# EAGLE design simple-slave (EAGLE 9.6.2)
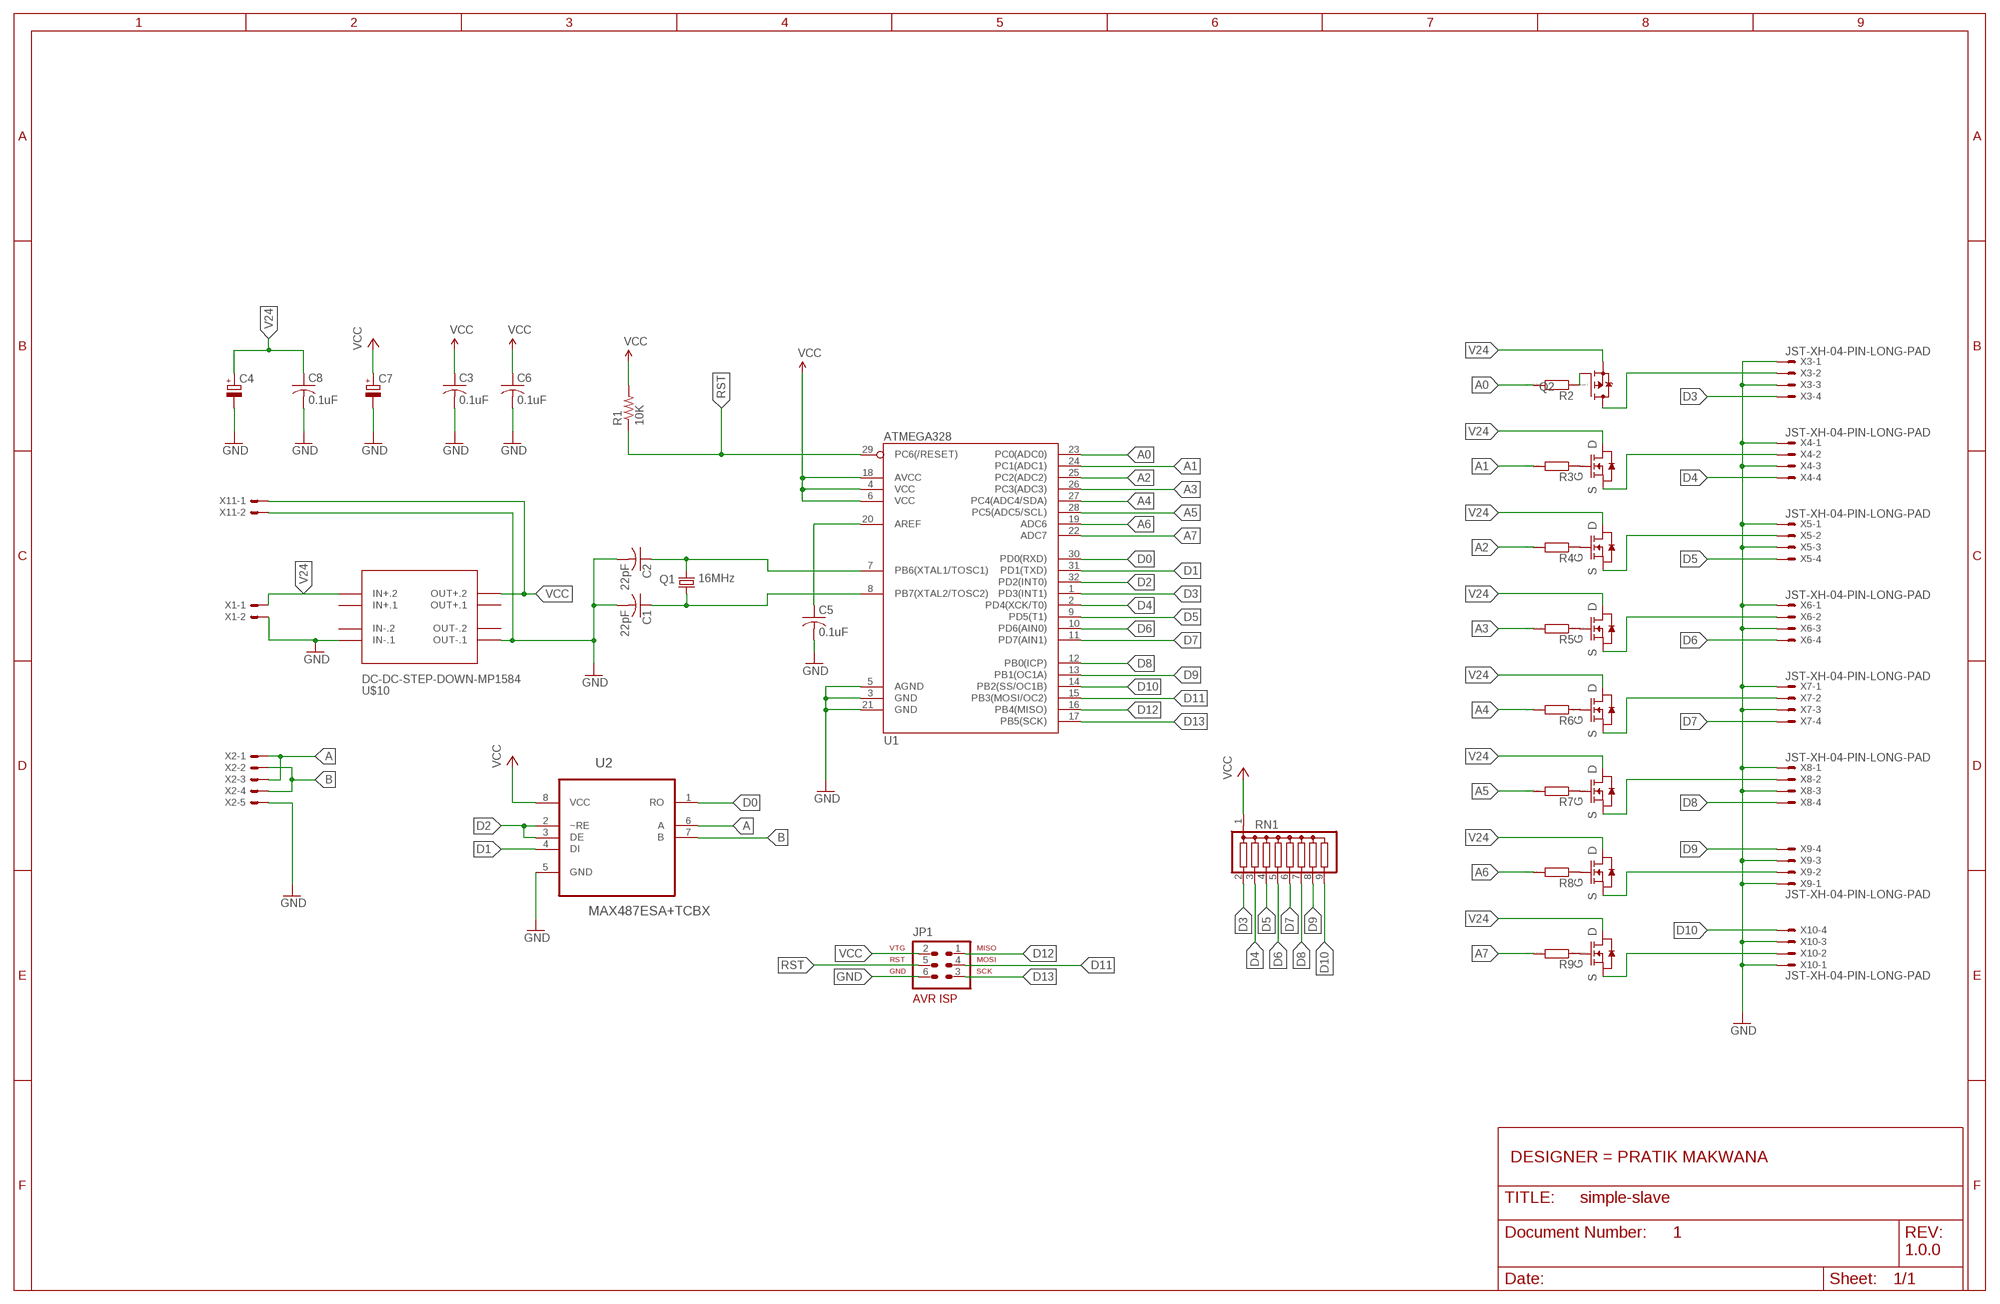
[diagram p0: schematic, sheet 1]
FRAME1 (FRAME_B_L): DESIGNER: PRATIK MAKWANA; DOC: 1; REV: 1.0.0

## Parts
C1  22pF  C-USC1206  [C1206]
C2  22pF  C-USC1206  [C1206]
C3  0.1uF  C-USC0805  [C0805]
C4  CPOL-EUSANYO_SMD_C6  [SANYO-OSCON_SMD_C6]
C5  0.1uF  C-USC0805  [C0805]
C6  0.1uF  C-USC0805  [C0805]
C7  CPOL-EUSANYO_SMD_C6  [SANYO-OSCON_SMD_C6]
C8  0.1uF  C-USC0805  [C0805]
JP1  AVR-ISP-6  [AVR-ISP-6]
Q1  16MHz  CRYTALHC49S  [HC49/S]
Q2  SPD30P06PTO252  [TO252]
R1  10K  R-US_R1206  [R1206]
R2  RR1206  [R1206]
R3  RR1206  [R1206]
R4  RR1206  [R1206]
R5  RR1206  [R1206]
R6  RR1206  [R1206]
R7  RR1206  [R1206]
R8  RR1206  [R1206]
R9  RR1206  [R1206]
RN1  G08R  [SIL9]
U1  ATMEGA328  [TQFP32-08]
U2  MAX487ESA+TCBX  [SOIC127P600X175-8N]
U$2  MOSFET-NTO252  [TO252]
U$3  MOSFET-NTO252  [TO252]
U$4  MOSFET-NTO252  [TO252]
U$5  MOSFET-NTO252  [TO252]
U$6  MOSFET-NTO252  [TO252]
U$7  MOSFET-NTO252  [TO252]
U$8  MOSFET-NTO252  [TO252]
U$10  DC-DC-STEP-DOWN-MP1584  [DC-DC-STEP-DOWN-MP1584]
X1  JST-XH-02-PIN-LONG-PAD  [JST-XH-02-PACKAGE-LONG-PAD]
X2  JST-XH-05-PIN-LONG-PAD  [JST-XH-05-PACKAGE-LONG-PAD]
X3  JST-XH-04-PIN-LONG-PAD  [JST-XH-04-PACKAGE-LONG-PAD]
X4  JST-XH-04-PIN-LONG-PAD  [JST-XH-04-PACKAGE-LONG-PAD]
X5  JST-XH-04-PIN-LONG-PAD  [JST-XH-04-PACKAGE-LONG-PAD]
X6  JST-XH-04-PIN-LONG-PAD  [JST-XH-04-PACKAGE-LONG-PAD]
X7  JST-XH-04-PIN-LONG-PAD  [JST-XH-04-PACKAGE-LONG-PAD]
X8  JST-XH-04-PIN-LONG-PAD  [JST-XH-04-PACKAGE-LONG-PAD]
X9  JST-XH-04-PIN-LONG-PAD  [JST-XH-04-PACKAGE-LONG-PAD]
X10  JST-XH-04-PIN-LONG-PAD  [JST-XH-04-PACKAGE-LONG-PAD]
X11  JST-XH-02-PIN-LONG-PAD  [JST-XH-02-PACKAGE-LONG-PAD]

## Nets
A: U2.6(A) X2.1 X2.3
A0: R2.2 U1.23(PC0(ADC0))
A1: R3.2 U1.24(PC1(ADC1))
A2: R4.2 U1.25(PC2(ADC2))
A3: R5.2 U1.26(PC3(ADC3))
A4: R6.2 U1.27(PC4(ADC4/SDA))
A5: R7.2 U1.28(PC5(ADC5/SCL))
A6: R8.2 U1.19(ADC6)
A7: R9.2 U1.22(ADC7)
AREF: C5.1 U1.20(AREF)
B: U2.7(B) X2.2 X2.4
D0: U1.30(PD0(RXD)) U2.1(RO)
D1: U1.31(PD1(TXD)) U2.4(DI)
D2: U1.32(PD2(INT0)) U2.2(~RE) U2.3(DE)
D3: RN1.2 U1.1(PD3(INT1)) X3.4
D4: RN1.3 U1.2(PD4(XCK/T0)) X4.4
D5: RN1.4 U1.9(PD5(T1)) X5.4
D6: RN1.5 U1.10(PD6(AIN0)) X6.4
D7: RN1.6 U1.11(PD7(AIN1)) X7.4
D8: RN1.7 U1.12(PB0(ICP)) X8.4
D9: RN1.8 U1.13(PB1(OC1A)) X9.4
D10: RN1.9 U1.14(PB2(SS/OC1B)) X10.4
D11: JP1.4 U1.15(PB3(MOSI/OC2))
D12: JP1.1 U1.16(PB4(MISO))
D13: JP1.3 U1.17(PB5(SCK))
GND: C1.2 C2.2 C3.2 C4.- C5.2 C6.2 C7.- C8.2 JP1.6 U1.3(GND) U1.5(AGND) U1.21(GND) U2.5(GND) U$10.IN-.1 U$10.OUT-.1 X1.2 X2.5 X3.1 X3.3 X4.1 X4.3 X5.1 X5.3 X6.1 X6.3 X7.1 X7.3 X8.1 X8.3 X9.1 X9.3 X10.1 X10.3 X11.2
N$1: Q2.1(G) R2.1
N$2: R3.1 U$2.P1(G)
N$4: R4.1 U$3.P1(G)
N$5: R5.1 U$4.P1(G)
N$6: R6.1 U$5.P1(G)
N$7: R7.1 U$6.P1(G)
N$8: R8.1 U$7.P1(G)
N$9: R9.1 U$8.P1(G)
N$11: Q2.3(D) X3.2
N$12: U$2.P3(S) X4.2
N$13: U$3.P3(S) X5.2
N$14: U$4.P3(S) X6.2
N$15: U$5.P3(S) X7.2
N$16: U$6.P3(S) X8.2
N$18: U$7.P3(S) X9.2
N$19: U$8.P3(S) X10.2
N$43: C2.1 Q1.2 U1.7(PB6(XTAL1/TOSC1))
N$44: C1.1 Q1.1 U1.8(PB7(XTAL2/TOSC2))
RST: JP1.5 R1.1 U1.29(PC6(/RESET))
V24: C4.+ C8.1 Q2.2(S) U$2.P2(D) U$3.P2(D) U$4.P2(D) U$5.P2(D) U$6.P2(D) U$7.P2(D) U$8.P2(D) U$10.IN+.2 X1.1
VCC: C3.1 C6.1 C7.+ JP1.2 R1.2 RN1.1 U1.4(VCC) U1.6(VCC) U1.18(AVCC) U2.8(VCC) U$10.OUT+.2 X11.1
Unconnected: U$10.IN+.1 U$10.IN-.2 U$10.OUT+.1 U$10.OUT-.2

## Library data of the parts
C1-C3 C5 C6 C8 = adafruit:C-US: CAPACITOR, American symbol
C4 C7 = rcl:CPOL-EU: POLARIZED CAPACITOR, European symbol; SPICEPREFIX: C
JP1 = atmel-1:AVR-ISP-6: AVR ISP-6 Serial Programming Header
Q1 = crystal:CRYTAL: CRYSTAL
Q2 = transistor-fet:SPD30P06P: SIPMOS(R) Power-Transistor P-Channel, Enhancement mode Source: http://www.infineon.com/upload/Document/cmc_upload/documents/012/3615/SPD_U30P06P.pdf
R1 = adafruit:R-US_: RESISTOR, American symbol
R2-R9 = eagle-ltspice:R: RESISTOR, European symbol; SPICEMODEL: NONE; SPICEPREFIX: R
RN1 = resistor-sil:G08R: SIL RESISTOR; OC_FARNELL: unknown; OC_NEWARK: unknown
U1 = thecustomgeek:ATMEGA328: ATmega328P-AU TQFP 32 pin
U2 = MAX487ESA_TCBX:MAX487ESA+TCBX: Low-Power, Slew-Rate-Limited RS-485/RS-422 Transceivers Check prices <https://pricing.snapeda.com/parts/MAX487ESA%2BTCBX/Maxim%20Integrated/view-part?ref=eda>; AVAILABILITY: Warning; DESCRIPTION: 1/1 Transceiver Half RS422, RS485 8-SOIC; MF: Maxim Integrated; MP: MAX487ESA+TCBX; PACKAGE: SOIC-8 Maxim Integrated; PRICE: None; PURCHASE-URL: https://pricing.snapeda.com/search/part/MAX487ESA+TCBX/?ref=eda
U$2-U$8 = dawidkulpa_dev:MOSFET-N
U$10 = diy-modules:DC-DC-STEP-DOWN-MP1584: DC/DC Step-Down Regulator based on MP1584 chip MP1584 datasheet available here: http://www.haoyuelectronics.com/Attachment/MP1584/MP1584.pdf Click here to find device on ebay.com <http://www.ebay.com/sch/mp1584+module>
X1 X11 = Rembrandt Electronics - JST XH Connectors v1-0:JST-XH-02-PIN: JST XH Connector 2 Pin Wire to board connector. Pitch: 2,54 mm, (0.100") Number of pins: 2 Created by Rembrandt Electronics www.rembrandtelectronics.com
X2 = Rembrandt Electronics - JST XH Connectors v1-0:JST-XH-05-PIN: JST XH Connector 2 Pin Wire to board connector. Pitch: 2,54 mm, (0.100") Number of pins: 5 Created by Rembrandt Electronics www.rembrandtelectronics.com
X3-X10 = Rembrandt Electronics - JST XH Connectors v1-0:JST-XH-04-PIN: JST XH Connector 2 Pin Wire to board connector. Pitch: 2,54 mm, (0.100") Number of pins: 4 Created by Rembrandt Electronics www.rembrandtelectronics.com

## Board
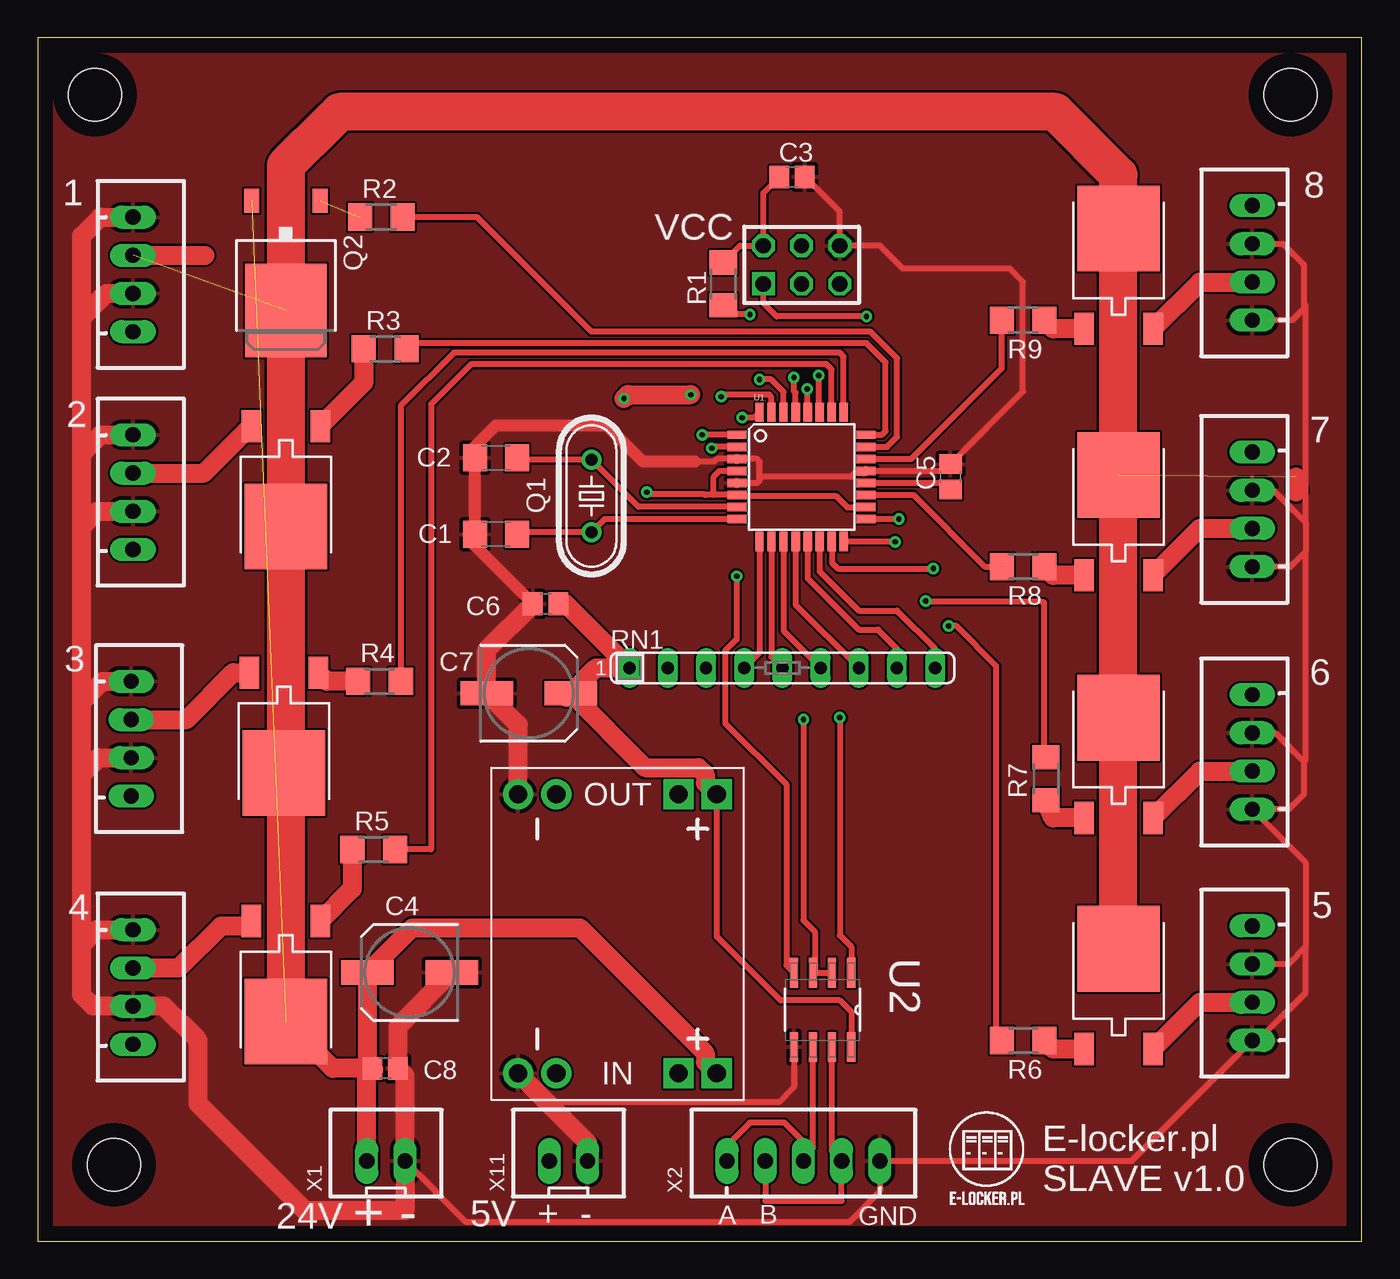
[diagram p1: board, top side]
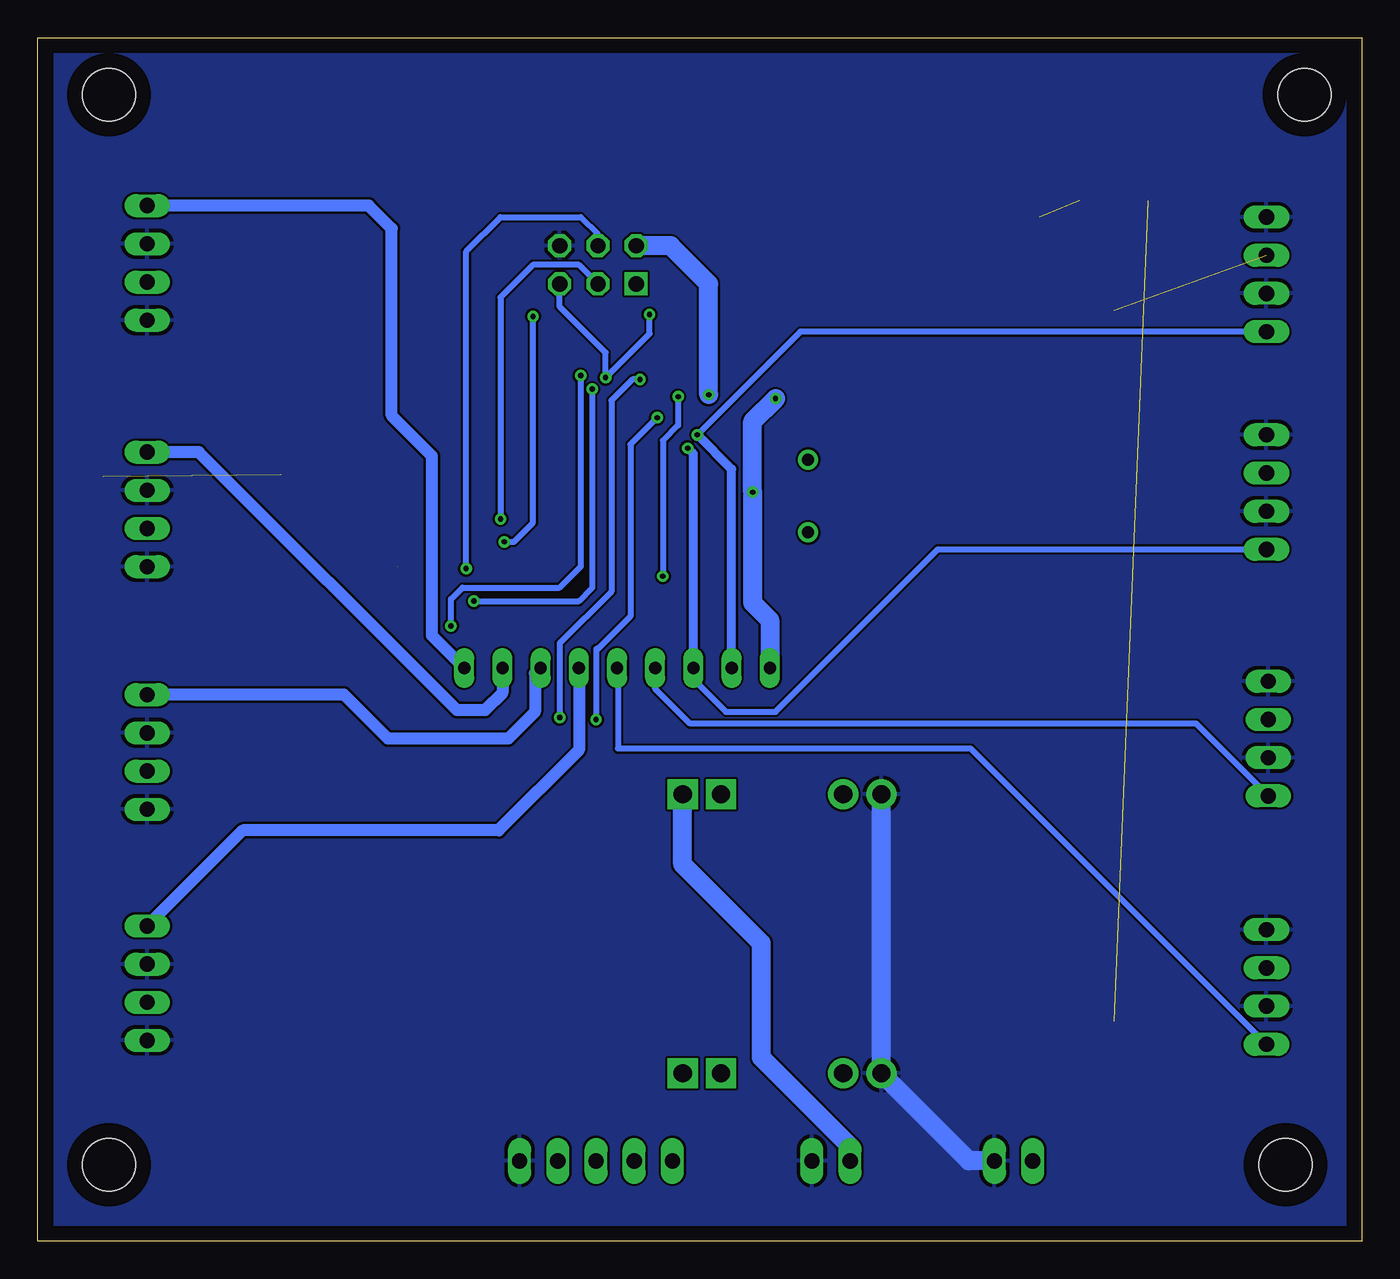
[diagram p2: board, bottom side, seen from below]

Size 88.06 x 80 mm. Coordinates in mm from the lower left corner, seen from the top.
Outline: 0,0 88.06,0 88.06,80 0,80 0,0
Copper layers (1*16): Top 0.035mm / dielectric 1.5mm / Bottom 0.035mm
Design rules "default": minimum track width 6mil, minimum drill 0.35mm, track to track 6mil, track to pad 6mil, pad to pad 6mil, via to via 6mil, smd to smd 6mil, copper to edge 40mil, drill to drill 6mil, minimum pad ring 10mil, minimum via ring 8mil, stop-mask expansion 4mil, vias tented up to drill 0mil, thermal gap 10mil
Holes 3.5 mm at 5.08,5.08 83.31,5.08 83.31,76.2 3.81,76.2

### Footprints (pad centres in the part's own frame; a part is rotated, then mirrored left to right if it is on the bottom)
C1206 = smd 1.6 x 1.8: 1 -1.4,0; 2 1.4,0
C0805 = smd 1.3 x 1.5: 1 -0.85,0; 2 0.85,0
SANYO-OSCON_SMD_C6 = smd 3.5 x 1.6: + 2.8,0; - -2.8,0
AVR-ISP-6 = drill 1.016 square: 1 -2.54,-1.27 | drill 1.016 octagon: 2 -2.54,1.27; 3 0,-1.27; 4 0,1.27; 5 2.54,-1.27; 6 2.54,1.27
HC49/S = drill 0.813: 1 -2.413,0; 2 2.413,0
TO252 = smd 1 x 1.6: 1 -2.28,-4.8; 2 2.28,-4.8 | smd 5.4 x 6.2: 3 0,2.5
R1206 = smd 1.6 x 1.803: 1 -1.422,0; 2 1.422,0
SIL9 = drill 0.813 long: 1 -10.16,0; 2 -7.62,0; 3 -5.08,0; 4 -2.54,0; 5 0,0; 6 2.54,0; 7 5.08,0; 8 7.62,0; 9 10.16,0
TQFP32-08 = smd 1.27 x 0.559: 1 -4.293,2.8; 2 -4.293,2; 3 -4.293,1.2; 4 -4.293,0.4; 5 -4.293,-0.4; 6 -4.293,-1.2; 7 -4.293,-2; 8 -4.293,-2.8; 17 4.293,-2.8; 18 4.293,-2; 19 4.293,-1.2; 20 4.293,-0.4; 21 4.293,0.4; 22 4.293,1.2; 23 4.293,2; 24 4.293,2.8 | smd 0.559 x 1.27: 9 -2.8,-4.293; 10 -2,-4.293; 11 -1.2,-4.293; 12 -0.4,-4.293; 13 0.4,-4.293; 14 1.2,-4.293; 15 2,-4.293; 16 2.8,-4.293; 25 2.8,4.293; 26 2,4.293; 27 1.2,4.293; 28 0.4,4.293; 29 -0.4,4.293; 30 -1.2,4.293; 31 -2,4.293; 32 -2.8,4.293
SOIC127P600X175-8N = smd 1.981 x 0.533: 1 -2.464,1.905; 2 -2.464,0.635; 3 -2.464,-0.635; 4 -2.464,-1.905; 5 2.464,-1.905; 6 2.464,-0.635; 7 2.464,0.635; 8 2.464,1.905
TO252' = smd 1.3 x 2.15: P1 -2.285,-4.38; P3 2.285,-4.38 | smd 5.5 x 5.7: P2 0,2.285
DC-DC-STEP-DOWN-MP1584 = drill 1.2 pad 2 square: IN+.1 -9.271,-4.064; IN+.2 -9.271,-6.604; OUT+.1 9.271,-4.064; OUT+.2 9.271,-6.604 | drill 1.2 pad 2: IN-.1 -9.271,6.604; IN-.2 -9.271,4.064; OUT-.1 9.271,6.604; OUT-.2 9.271,4.064
JST-XH-02-PACKAGE-LONG-PAD = drill 1.016 long: 1 -1.27,0; 2 1.27,0
JST-XH-05-PACKAGE-LONG-PAD = drill 1.016 long: 1 -5.08,0; 2 -2.54,0; 3 0,0; 4 2.54,0; 5 5.08,0
JST-XH-04-PACKAGE-LONG-PAD = drill 1.016 long: 1 -3.81,0; 2 -1.27,0; 3 1.27,0; 4 3.81,0

### Placement (x,y rotation side)
C1  30.48,46.99 180 top
C2  30.48,52.07 180 top
C3  50.16,70.74 0 top
C4  24.74,17.86 180 top
C5  60.71,50.8 90 top
C6  33.78,42.37 180 top
C7  32.66,36.42 0 top
C8  23.11,11.48 0 top
JP1  50.8,64.9 0 top
Q1  36.83,49.53 90 top
Q2  16.51,64.36 180 top
R1  45.59,63.63 90 top
R2  22.86,68.07 0 top
R3  23.11,59.31 0 top
R4  22.73,37.21 0 top
R5  22.35,26.04 0 top
R6  65.53,13.34 180 top
R7  67.06,30.73 90 top
R8  65.53,44.83 180 top
R9  65.53,61.21 180 top
RN1  49.53,38.1 0 top
U1  50.8,50.8 0 top
U2  52.2,15.37 270 top
U$2  [TO252']  16.51,49.78 180 top
U$3  [TO252']  16.38,33.4 180 top
U$4  [TO252']  16.51,16.89 180 top
U$5  [TO252']  71.88,17.14 0 top
U$6  [TO252']  71.88,32.51 0 top
U$7  [TO252']  71.88,48.64 0 top
U$8  [TO252']  71.88,65.02 0 top
U$9  [ELOCKER]  60.6,2.18 0 top
U$10  38.56,20.42 90 top
X1  23.16,5.33 0 top
X2  50.93,5.33 0 top
X3  6.35,64.26 270 top
X4  6.35,49.78 270 top
X5  6.22,33.4 270 top
X6  6.35,16.89 270 top
X7  80.77,17.14 90 top
X8  80.77,32.51 90 top
X9  80.77,48.64 90 top
X10  80.77,65.02 90 top
X11  35.31,5.33 0 top

### Tracks (layer width: path | path; a pad name or v marks a point on that pad's centre or on a via)
A
  Top 0.406: U2.6 51.56,6.22 51.44,6.1 | X2.3 50.93,5.59 51.44,6.1 | 51.44,6.1 49.66,7.87 47.37,7.87 45.85,6.35 X2.1
A0
  Top 0.406: U1.23 56.48,52.8 57.15,53.47 57.15,58.67 55.37,60.45 36.83,60.45 29.21,68.07 R2.2
A1
  Top 0.406: U1.24 56.14,53.6 56.39,53.85 56.39,58.42 55.12,59.69 24.92,59.69 R3.2
A2
  Top 0.406: U1.25 53.6,58.8 53.34,59.05 27.69,59.05 24.16,55.52 R4.2
A3
  Top 0.406: U1.26 52.8,57.94 52.45,58.29 28.83,58.29 26.16,55.63 26.16,26.04 R5.2
A4  (via drill 0.35)
  Top 0.406: U1.27 51.94,55.15 v51.94,57.53 | R6.2 63.75,13.69 63.75,38.23 61.09,40.89 v60.58,40.89
  Bottom 0.406: v60.58,40.89 60.58,42.67 59.82,43.43 53.34,43.43 51.94,44.83 v51.94,57.53
A5  (via drill 0.35)
  Top 0.406: U1.28 51.18,55.11 v51.18,56.64 | R7.2 66.93,32.28 66.93,42.46 66.53,42.55 v59.05,42.55
  Bottom 0.406: v51.18,56.64 51.18,43.43 52.07,42.55 v59.05,42.55
A6  (1 unrouted)
  Top 0.406: U1.19 58.22,49.6 62.99,44.83 R8.2
A7
  Top 0.406: U1.22 58.1,52 64.11,58.01 R9.2
AREF
  Top 0.406: U1.20 60.26,50.4 C5.1
B
  Top 0.406: U2.7 52.83,5.97 X2.4 53.47,2.67 48.39,2.67 X2.2
D0  (via drill 0.35)
  Top 0.406: U1.30 49.6,56.45 48.77,57.28 v48.01,57.28 | v53.34,34.8 53.34,20.32 54.1,19.56 U2.1
  Bottom 0.406: v48.01,57.28 48.51,57.28 49.91,55.88 49.91,43.18 53.34,39.75 v53.34,34.8
D1  (via drill 0.35)
  Top 0.406: U1.31 48.8,56.1 48.64,56.26 45.59,56.26 v45.47,56.13 | v46.48,44.2 46.48,40.01 45.72,39.24 45.72,34.42 49.78,30.35 49.78,18.34 U2.4
  Bottom 0.406: v45.47,56.13 45.47,54.23 46.48,53.21 v46.48,44.2
D2  (via drill 0.35)
  Top 0.406: U2.2 U2.3 51.69,17.96 51.69,20.57 50.93,21.34 v50.93,34.67 | U1.32 47.64,54.74 v46.86,54.74
  Bottom 0.406: v46.86,54.74 48.64,52.96 48.64,41.53 50.8,39.37 50.93,39.37 v50.93,34.67
D3  (via drill 0.35)
  Top 0.406: U1.1 v44.2,53.6 v44.2,53.59
  Bottom 0.406: X3.4 37.34,60.45 v44.2,53.59
  Bottom 0.61: RN1.2 41.91,51.31 v44.2,53.59
D4  (via drill 0.35)
  Top 0.406: U1.2 44.93,52.8 v44.83,52.7
  Bottom 0.406: RN1.3 44.45,37.34 42.29,35.18 38.99,35.18 28.19,45.97 X4.4
  Bottom 0.61: RN1.3 44.45,52.32 v44.83,52.7
D5
  Top 0.406: U1.9 48,39.11 RN1.4
  Bottom 0.406: X5.4 11.02,34.39 44.68,34.39 46.99,36.7 RN1.4
D6
  Top 0.406: U1.10 48.8,38.83 RN1.5
  Bottom 0.406: X6.4 26.01,32.74 49.48,32.74 49.48,38.05 RN1.5
D7
  Top 0.406: U1.11 49.6,40.57 RN1.6
  Bottom 0.813: RN1.6 52.07,32.64 57.4,27.3 74.42,27.3 X7.4
D8
  Top 0.406: U1.12 50.4,42.31 RN1.7
  Bottom 0.813: RN1.7 54.99,37.72 54.99,35.18 56.77,33.4 64.77,33.4 67.69,36.32 X8.4
D9
  Top 0.406: U1.13 51.2,44.05 54.61,40.64 55.88,40.64 57.15,39.37 RN1.8
  Bottom 0.813: X9.4 77.34,52.45 60.2,35.31 58.29,35.31 57.15,36.45 RN1.8
D10
  Top 0.406: U1.14 52,44.52 54.61,41.91 57.15,41.91 59.69,39.37 RN1.9
  Bottom 0.813: X10.4 66.04,68.83 64.52,67.31 64.52,54.86 61.85,52.2 61.85,40.26 RN1.9
D11  (via drill 0.35)
  Top 0.406: U1.15 52.83,46.48 52.83,45.09 53.21,44.7 v59.56,44.7
  Bottom 0.406: v59.56,44.7 59.56,65.79 57.28,68.07 51.94,68.07 50.8,66.93 JP1.4
D12  (via drill 0.35)
  Top 0.406: U1.16 57,46.51 v57.02,46.48 | v55.12,61.47 49.15,61.47 48.26,62.36 JP1.1
  Bottom 0.406: v57.02,46.48 56.39,46.48 55.12,47.75 v55.12,61.47
D13  (via drill 0.35)
  Top 0.406: U1.17 v57.28,48.01
  Bottom 0.406: JP1.3 52.07,64.9 55.12,64.9 57.28,62.74 v57.28,48.01
GND
  Top 0.406: U1.5 47.86,50.4 48.01,50.55 48.01,50.8 | 48.01,50.8 48.01,51.82 47.82,52 U1.3 45.16,52 44.98,51.82 43.69,51.82 | 48.01,50.8 54.08,50.8 54.31,51.03 54.93,51.03 U1.21 60.26,51.2 C5.2 65.53,56.48 65.53,63.75 64.64,64.64 57.53,64.64 56.01,66.17 JP1.6 53.34,68.41 C3.2 | X10.3 82.8,66.29 84.2,64.9 84.2,62.36 | 84.2,62.36 84.2,61.98 83.44,61.21 X10.1 | X9.3 82.17,49.91 84.33,47.75 | 84.33,47.75 84.33,45.85 | X9.1 83.31,44.83 84.33,45.85 | 84.33,47.75 84.33,62.23 84.2,62.36 | X8.3 82.3,33.78 84.2,31.88 | 84.2,31.88 84.2,29.72 83.19,28.7 X8.1 84.33,25.15 84.33,19.56 | 84.2,31.88 84.33,32 84.33,45.85 | 84.33,19.56 83.19,18.41 X7.3 | 84.33,19.56 84.33,16.51 81.15,13.34 X7.1 72.77,5.33 X2.5 56.01,3.3 53.98,1.27 28.5,1.27 X1.2 | U2.5 50.29,10.21 49.33,9.25 33.27,9.25 33.27,9.83 U$10.IN-.1
  Top 0.813: C6.2 29.08,46.22 C1.2 C2.2 29.08,52.83 30.48,54.23 37.85,54.23 40.26,51.82 43.69,51.82
  Top 1.27: 2.92,19.68 2.92,16.38 3.68,15.62 X6.3 8.38,15.62 10.67,13.34 10.67,9.14 17.78,2.03 24.43,2.03 X1.2 24.43,11.01 C8.2 23.96,14.28 C4.- | 2.92,19.68 3.94,20.7 X6.1 | 2.92,19.68 2.92,30.99 | X5.3 4.06,32.13 2.92,30.99 | 2.92,30.99 2.92,35.81 | X5.1 4.32,37.21 2.92,35.81 | 2.92,35.81 2.92,47.5 | X4.3 3.94,48.51 2.92,47.5 | 2.92,47.5 2.92,52.32 | X4.1 4.19,53.59 2.92,52.32 | 2.92,52.32 2.92,61.34 | X3.3 4.57,62.99 2.92,61.34 | 2.92,61.34 2.92,66.8 4.19,68.07 X3.1 | U$10.OUT-.1 31.95,34.34 C7.- 29.86,39.3 C6.2 | X11.2 36.58,6.53 U$10.IN-.1
  Bottom 1.27: X1.2 26.14,5.33 U$10.IN-.1 U$10.OUT-.1
  pour Bottom: 0.51,79.63 87.5,79.63 87.5,1.02 87,0.51 1.02,0.51 0.64,0.89 0.64,79.5
  pour Top: 0.38,79.63 87.38,79.63 87.5,79.5 87.5,0.64 0.64,0.64 0.51,0.51 0.51,79.5
N$1  (1 unrouted)
N$2
  Top 1.27: R3.1 21.69,57.06 U$2.P1
N$4
  Top 1.27: R4.1 19.24,37.21 U$3.P1
N$5
  Top 1.27: R5.1 20.93,23.41 U$4.P1
N$6
  Top 1.27: U$5.P1 67.52,12.77 R6.1
N$7
  Top 1.27: U$6.P1 67.52,28.13 R7.1
N$8
  Top 1.27: U$7.P1 67.52,44.26 R8.1
N$9
  Top 1.27: U$8.P1 67.52,60.64 R9.1
N$11  (1 unrouted)
  Top 1.27: X3.2 11.12,65.53
N$12
  Top 0.813: 14.22,53.85 U$2.P3
  Top 1.27: X4.2 11.05,51.05 13.84,53.85 14.22,53.85
N$13
  Top 1.27: X5.2 9.91,34.67 13.02,37.78 U$3.P3
N$14
  Top 0.813: 14.22,20.96 U$4.P3
  Top 1.27: X6.2 9.4,18.16 12.19,20.96 14.22,20.96
N$15
  Top 1.27: U$5.P3 77.28,15.88 X7.2
N$16
  Top 1.27: U$6.P3 77.28,31.24 X8.2
N$18
  Top 1.27: X9.2 77.28,47.37 U$7.P3
N$19
  Top 1.27: X10.2 77.28,63.75 U$8.P3
N$43
  Top 0.406: U1.7 39.97,48.8 Q1.2 32.01,51.94 C2.1
N$44
  Top 0.406: U1.8 37.71,48 Q1.1 32.01,47.12 C1.1
RST  (via drill 0.35)
  Top 0.406: U1.29 50.4,56.41 50.29,56.52 v50.29,57.4 | v47.37,61.59 46.2,61.59 R1.1
  Bottom 0.406: JP1.5 53.34,62.1 50.29,59.05 v50.29,57.4 47.37,60.33 v47.37,61.59
V24  (2 unrouted)
  Top 1.27: C8.1 22.35,11.39 21.89,10.94 X1.1 | U$2.P2 16.51,31.24 U$3.P2 16.38,14.73 U$4.P2 19.64,11.48 C8.1 | 83.82,49.91 83.69,49.78 83.69,50.8 | U$6.P2 71.88,33.78 72.26,33.78 | 72.14,18.92 72.26,18.92 72.26,19.05 U$5.P2 | 62.1,75.06 20.07,75.06 19.56,74.55 | C8.1 21.94,11.8 C4.+ 24.91,20.83 36.06,20.83 44.41,12.48 44.41,11.9 U$10.IN+.2
  Top 2.54: 20.07,75.06 67.69,75.06 71.88,70.87 U$8.P2 U$7.P2 U$6.P2 U$5.P2 | 19.56,74.55 16.51,71.5 U$4.P2
VCC  (via drill 0.35)
  Top 0.406: 44.96,49.6 U1.6 46.58,49.53 53.09,49.53 53.85,48.77 55.06,48.77 U1.18 | 44.96,49.6 44.38,49.6 44.32,49.66 40.64,49.66 v40.51,49.78 | 44.96,49.6 44.96,50.8 45.36,51.2 U1.4 | U2.8 54.1,15.24 53.34,16 49.4,16 45.16,20.24 U$10.OUT+.2 | R1.2 46.71,66.17 JP1.2 48.26,69.68 C3.1
  Top 1.27: C6.1 35.1,42.37 RN1.1 37.14,38.1 C7.+ | 35.18,36.14 C7.+ | v38.99,56.01 39.24,56.26 v43.43,56.26 | C7.+ 40.41,31.48 43.95,31.48 44.41,31.02 44.41,30.45 U$10.OUT+.2
  Bottom 1.27: RN1.1 39.37,41.27 40.51,42.42 v40.51,49.78 40.51,54.48 v38.99,56.01 | v43.43,56.26 43.43,63.63 45.97,66.17 JP1.2 | X11.1 34.04,6.3 39.93,12.19 39.93,19.81 45.16,25.04 U$10.OUT+.2

### Text on the board
tPlace: + - | A | B | GND
tNames: 1 | 8 | VCC | 2 | 7 | 3 | 6 | 4 | 5 | E-locker.pl / SLAVE v1.0 | 24V | 5V + -